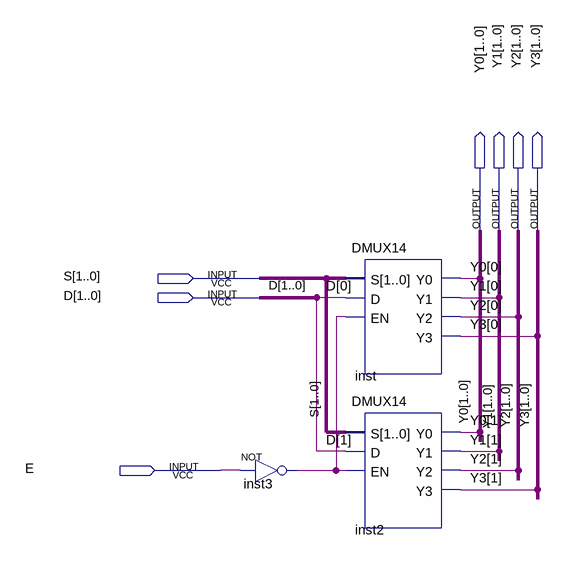
[diagram p0: schematic sheet]
// Quartus schematic 2DMUX14.bdf as structural Verilog: 3 symbols, 7 pins
module \2DMUX14  (
  input  [1:0] S,
  input  [1:0] D,
  input  E,
  output [1:0] Y0,
  output [1:0] Y1,
  output [1:0] Y2,
  output [1:0] Y3
);

  wire inst3_out;

  not inst3 (inst3_out, E);
  DMUX14 inst (.S(S), .D(D[0]), .EN(inst3_out), .Y0(Y0[0]), .Y1(Y1[0]), .Y2(Y2[0]), .Y3(Y3[0]));
  DMUX14 inst2 (.S(S), .D(D[1]), .EN(inst3_out), .Y0(Y0[1]), .Y1(Y1[1]), .Y2(Y2[1]), .Y3(Y3[1]));
endmodule
